# EAGLE design esp32-gps-eth-mod-gps-lora (EAGLE 7.3.0)
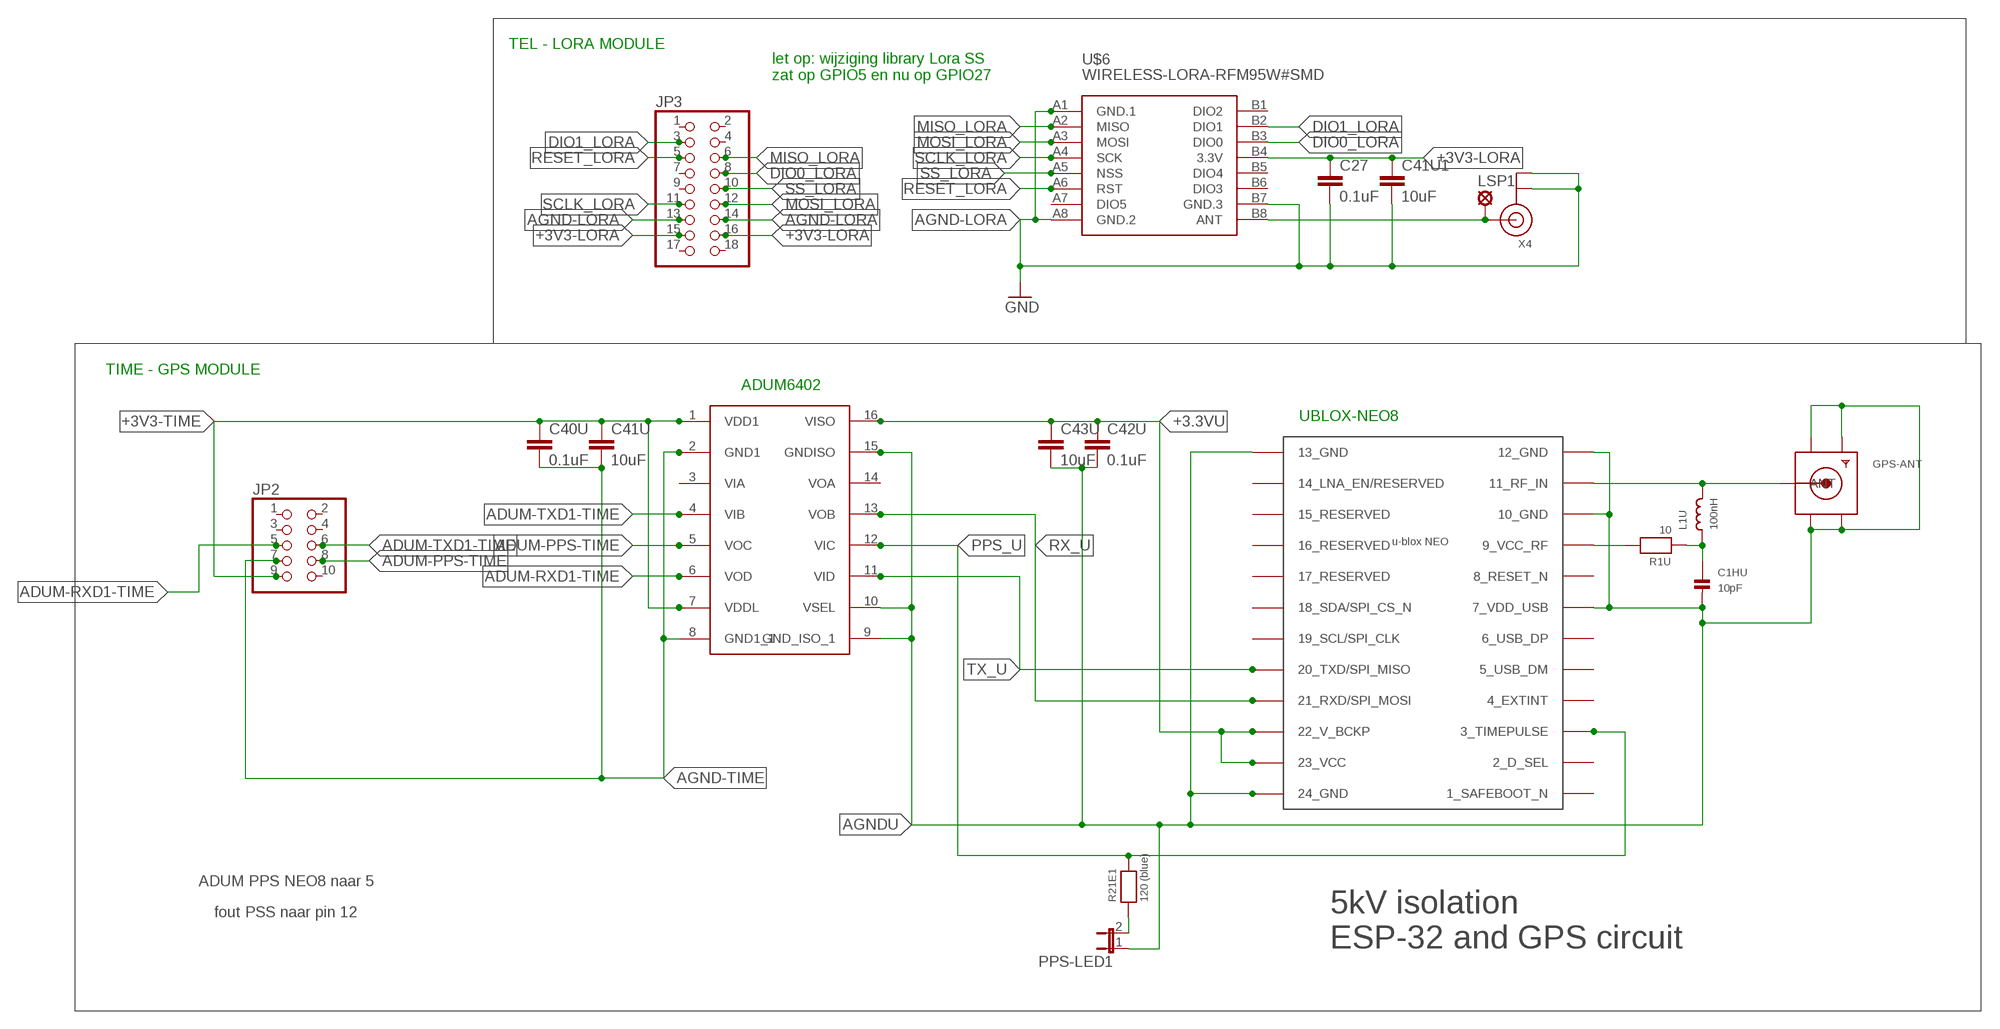
[diagram p0: schematic, sheet 1]

## Parts
C1HU  10pF  CAP_CERAMIC_0805  [_0805]
C27  0.1uF  C-EUC0805  [C0805]
C40U  0.1uF  C-EUC0805  [C0805]
C41U  10uF  C-EUC0805  [C0805]
C41U1  10uF  C-EUC0805  [C0805]
C42U  0.1uF  C-EUC0805  [C0805]
C43U  10uF  C-EUC0805  [C0805]
GPS-ANT  SMACONNECTOR  [SMA90_DIP]
JP2  PINHD-2X5/90  [2X05/90]
JP3  PINHD-2X9/90  [2X09/90]
L1U  100nH  INDUCTOR0805  [0805]
LSP1  LSP10  [LSP10]
PPS-LED1  JP1E  [JP1]
R1U  10  RESISTOR_0805  [_0805]
R21E1  120 (blue)  RESISTOR_0805  [_0805]
U$2  ADUM6402  [SOIC16R]
U$6  WIRELESS-LORA-RFM95W#SMD  [WIRELESS-LORA-RFM95W#SMD]
UBLOX-NEO8  NEO-M8  [NEO-M8]
X4  ANTENNA_U.FL  [U.FL]

## Nets
+3.3VU: C42U.1 C43U.1 U$2.16(VISO) UBLOX-NEO8.22(22_V_BCKP) UBLOX-NEO8.23(23_VCC)
+3V3-LORA: C27.1 C41U1.1 JP3.15 JP3.16 U$6.B4(3.3V)
+3V3-TIME: C40U.1 C41U.1 JP2.9 U$2.1(VDD1) U$2.7(VDDL)
ADUM-PPS-TIME: JP2.8 U$2.5(VOC)
ADUM-RXD1-TIME: JP2.5 U$2.6(VOD)
ADUM-TXD1-TIME: JP2.6 U$2.4(VIB)
AGND-LORA: C27.2 C41U1.2 JP3.13 JP3.14 U$6.A1(GND.1) U$6.A8(GND.2) U$6.B7(GND.3) X4.1(GND) X4.2(GND) ; supply symbol labelled GND
AGND-TIME: C40U.2 C41U.2 JP2.7 U$2.2(GND1) U$2.8(GND1_1)
AGNDU: C1HU.2 C42U.2 C43U.2 GPS-ANT.GND1 GPS-ANT.GND2 GPS-ANT.GND3 GPS-ANT.GND4 PPS-LED1.1 U$2.9(GND_ISO_1) U$2.10(VSEL) U$2.15(GNDISO) UBLOX-NEO8.7(7_VDD_USB) UBLOX-NEO8.10(10_GND) UBLOX-NEO8.12(12_GND) UBLOX-NEO8.13(13_GND) UBLOX-NEO8.24(24_GND)
DIO0_LORA: JP3.8 U$6.B3(DIO0)
DIO1_LORA: JP3.3 U$6.B2(DIO1)
MISO_LORA: JP3.6 U$6.A2(MISO)
MOSI_LORA: JP3.12 U$6.A3(MOSI)
N$7: PPS-LED1.2 R21E1.1
N$19: R1U.2 UBLOX-NEO8.9(9_VCC_RF)
N$27: LSP1.MP U$6.B8(ANT) X4.3(SIGNAL)
N$30: C1HU.1 L1U.1 R1U.1
N$31: GPS-ANT.ANTENNA(ANT) L1U.2 UBLOX-NEO8.11(11_RF_IN)
PPS_U: R21E1.2 U$2.12(VIC) UBLOX-NEO8.3(3_TIMEPULSE)
RESET_LORA: JP3.5 U$6.A6(RST)
RX_U: U$2.13(VOB) UBLOX-NEO8.21(21_RXD/SPI_MOSI)
SCLK_LORA: JP3.11 U$6.A4(SCK)
SS_LORA: JP3.10 U$6.A5(NSS)
TX_U: U$2.11(VID) UBLOX-NEO8.20(20_TXD/SPI_MISO)
Unconnected: JP2.1 JP2.2 JP2.3 JP2.4 JP2.10 JP3.1 JP3.2 JP3.4 JP3.7 JP3.9 JP3.17 JP3.18 U$2.3(VIA) U$2.14(VOA) U$6.A7(DIO5) U$6.B1(DIO2) U$6.B5(DIO4) U$6.B6(DIO3) UBLOX-NEO8.1(1_SAFEBOOT_N) UBLOX-NEO8.2(2_D_SEL) UBLOX-NEO8.4(4_EXTINT) UBLOX-NEO8.5(5_USB_DM) UBLOX-NEO8.6(6_USB_DP) UBLOX-NEO8.8(8_RESET_N) UBLOX-NEO8.14(14_LNA_EN/RESERVED) UBLOX-NEO8.15(15_RESERVED) UBLOX-NEO8.16(16_RESERVED) UBLOX-NEO8.17(17_RESERVED) UBLOX-NEO8.18(18_SDA/SPI_CS_N) UBLOX-NEO8.19(19_SCL/SPI_CLK)

## Notes on the sheet
- TEL - LORA MODULE
- let op: wijziging library Lora SS 
  zat op GPIO5 en nu op GPIO27
- TIME - GPS MODULE
- ADUM6402
- UBLOX-NEO8
- ADUM PPS NEO8 naar 5
- fout PSS naar pin 12
- 5kV isolation
  ESP-32 and GPS circuit

## Library data of the parts
C1HU = microbuilder:CAP_CERAMIC: Ceramic Capacitors 0402 - 0402 Surface Mount Capacitors 16pF 50V 5% [Digikey: 445-4899-2-ND] 18pF 50V 5% [Digikey: 490-1281-2-ND] 22pF 50V 5% [Digikey: 490-1283-2-ND] 68pF 50V 5% [Digikey: 490-1289-2-ND] 0.1uF 10V 10% [Digikey: 490-1318-2-ND] 1.0uF 6.3V 10% [Digikey: 490-1320-2-ND] 0603 - 0603 Surface Mount Capacitors 16 pF 50V 5% [Digikey: 445-5051-2-ND] 22 pF 50V [Digikey: PCC220ACVTR-ND] 33 pF 50V 5% [Digikey: 490-1415-1-ND] 56pF 50V 5% [Digikey: 490-1421-1-ND] 220pF 50V 5% [Digikey: 445-1285-1-ND] 680 pF 50V 2200 pF 50V 5% C0G [Digikey: 445-1297-1-ND] 5600 pF 100V 5% X7R [Digikey: 478-3711-1-ND] 0.1 µF 25V 10% [Digikey: PCC2277TR-ND] 0.22 µF 16V 10% X7R [Digikey: 445-1318-1-ND] 1.0 µF 25V 10% [Digikey: 445-5146-2-ND] 0603 - RF Specific 3pF 250V +/-0.1pF RF [Digikey: 712-1347-1-ND] 18 pF 250V 5% [Digikey: 478-3505-1-ND or 712-1322-1-ND] 56 pF 250V 5% C0G RF [Digikey: 490-4867-1-ND] 68 pF 250V RF [Digikey: 490-4868-1-ND] 0805 - 0805 Surface Mount Capacitors 220 pF 250V 2% RF Ceramic Capacitor [Digikey: 712-1398-1-ND] 1000 pF 50V 2% NP0 Ceramic Capacitor [Digikey: 478-3760-1-ND] 0.1 µF 25V 10% Ceramic Capacitor [Digikey: PCC1828TR-ND] 1.0 µF 16V 10% Ceramic Capacitor[Digikey: 490-1691-2-ND] 10.0 µF 10V 10% Ceramic Capacitor[Digikey: 709-1228-1-ND] 10.0 uF 16V 10% Ceramic Capacitor [Digikey: 478-5165-2-ND] 47 uF 6.3V 20% Ceramic Capacitor [Digikey: 587-1779-1-ND or 399-5506-1-ND] 1206 - 1206 Surface Mount Capacitors 47uF 10V 20% Ceramic Capacitor [Digikey: 490-5528-1-ND or 399-5508-1-ND or 445-6010-1-ND] 100uF 6.3V -20%, +80% Y5V Ceramic Capacitor (Digikey: 490-4512-1-ND, Mouser: 81-GRM31CF50J107ZE1L)
C27 C40U C41U C41U1 C42U C43U = Schematics:C-EU: CAPACITOR, European symbol
GPS-ANT = adafruit:SMACONNECTOR: SMA Connector 90° DIP SMA Connector, 50 Ohm (4UConnector: 07259)
JP2 = pinhead:PINHD-2X5: PIN HEADER
JP3 = pinhead:PINHD-2X9: PIN HEADER
L1U = microbuilder:INDUCTOR: Inductors 0603: 10nH Ceramic Inductor - microwire antenna/RF (Digikey: 712-1434-2-ND) 0805: 560nH Ceramic Inductor - RF (Digikey: 553-1047-1-ND) 270nH Ceramic Inductor - Q = 40@250MHz, +-5%, 1 Ohm DC Resistance (Digikey: 535-10506-2-ND) 1007 (2518 Metric) SMT: 10µH 10% 250mOhm 820mA 1007 Inductor (Digikey: 587-2189-1-ND) 22µH 10% 500mOhm 580mA 1007 Inductor (Digikey: 587-2190-1-ND) 47µH 10% 950mOhm 420mA 1007 Inductor (Digikey: 587-2191-1-ND) 47µH 5% 100mOhm 1A 1008 Inductor (Digikey: 732-1816-1-ND) 5.0x5.0mm (Taiyo Yuden NR5040 Series) 6.8µH 20% 2.3A 64mOhm Inductor (Digikey: 587-2374-2-ND) 5.0x5.0mm (TDK VLC5045 Series) 4.7µH 20% 3.3A 34mOhm Inductor (Digikey: 445-6526-1-ND) 6.8µH 20% 2.7A 46mOhm Inductor (Digikey: 445-6527-1-ND) 6.0x6.0mm (TDK VLC6045 Series) 4.7µH 20% 3.8A 27mOhm Inductor (Digikey: 445-6538-2-ND) 6.8µH 20% 3A 41mOhm Inductor (Digikey: 445-6540-1-ND) 6.2µH 30% 2.2A 45mOhm Inductor (Digikey: SRR5028-6R2YCT-ND) - Not TDK VLC6045 but footprint should match 6.0x6.0mm (TDK SLF6045 Series) 6.8uH 30% 2A 33mOhm Inductor (Digikey: 445-4572-1-ND, Mouser: 810-SLF645T6R8N2R0PF)
LSP1 = solpad:LSP10: SOLDER PAD drill 1.0 mm, distributor Buerklin, 12H555
PPS-LED1 = jumper:JP1E: JUMPER
R1U R21E1 = microbuilder:RESISTOR: Resistors 0402 - 0402 Surface Mount Package 22 Ohm 1% 1/16W [Digikey: 311-22.0LRTR-ND] 33 Ohm 5% 1/16W 1.0K 5% 1/16W 1.5K 5% 1/16W 2.0K 1% 1/16W 10.0K 1% 1/16W [Digikey: 311-10.0KLRTR-ND] 10.0K 5% 1/16W [Digikey: RMCF0402JT10K0TR-ND] 12.1K 1% 1/16W [Digikey: 311-22.0LRTR-ND] 100.0K 5% 1/16W 0603 - 0603 Surface Mount Package 0 Ohm 1/10 Watt 1% Resistor 15 Ohm 1/10 Watt 1% Resistor 33 Ohm 1/10 Watt 1% Resistor 49.9 Ohm 1/10 Watt 1% Resistor 100 Ohm 1/10 Watt 1% Resistor 150 Ohm 1/10 Watt 1% Resistor 240 Ohm 1/10 Watt 1% Resistor 390 Ohm 1/10 Watt 1% Resistor 560 Ohm 1/10 Watt 1% Resistor 680 Ohm 1/10 Watt 1% Resistor 750 Ohm 1/10 Watt 1% Resistor 1.0K Ohm 1/10 Watt 1% Resistor 1.5K Ohm 1/10 Watt 1% Resistor 2.0K Ohm 1/10 Watt 1% Resistor 2.2K Ohm 1/10 Watt 1% Resistor 3.3K Ohm 1/10 Watt 1% Resistor 4.7K Ohm 1/10 Watt 1% Resistor 10.0K Ohm 1/10 Watt 1% Resistor 12.0K Ohm 1/10 Watt 1% Resistor 12.1K Ohm 1/10 Watt 1% Resistor 20.0K Ohm 1/10 Watt 1% Resistor 33.0K Ohm 1/10 Watt 1% Resistor 100.0K Ohm 1/10 Watt 1% Resistor 0805 - 0805 Surface Mount Package 0 Ohm 1/8 Watt 1% Resistor 33 Ohm 1/8 Watt 1% Resistor 100 Ohm 1/8 Watt 1% Resistor 150 Ohm 1/8 Watt 1% Resistor 200 Ohm 1/8 Watt 1% Resistor 240 Ohm 1/8 Watt 1% Resistor 330 Ohm 1/8 Watt 1% Resistor 390 Ohm 1/8 Watt 1% Resistor 470 Ohm 1/8 Watt 1% Resistor 1.0K Ohm 1/8 Watt 1% Resistor 1.5K Ohm 1/8 Watt 1% Resistor 2.0K Ohm 1/8 Watt 1% Resistor 4.7K Ohm 1/8 Watt 1% Resistor 5.1K Ohm 1/8 Watt 1% Resistor 5.6K Ohm 1/8 Watt 1% Resistor 10.0K Ohm 1/8 Watt 1% Resistor 22.0K Ohm 1/8 Watt 1% Resistor 33.0K Ohm 1/8 Watt 1% Resistor 100K Ohm 1/8 Watt 1% Resistor 1206 - 1206 Surface Mount Package 2012 - 2010 Surface Mount Package 0.11 Ohm 1/2 Watt 1% Resistor - Digikey: RHM.11UCT-ND
U$2 = ADUM6402:ADUM6402
U$6 = diy-modules:WIRELESS-LORA-RFM95W: 868/915 MHz LoRa Radio Transceiver Module based on SX1276 chip Click here to find device on ebay.com <http://www.ebay.com/sch/RFM95W+transceiver>
UBLOX-NEO8 = ubloxLib:NEO-M8: u-blox NEO GNSS module
X4 = adafruit:ANTENNA_U.FL: U.FL Antenna Connector

## Board
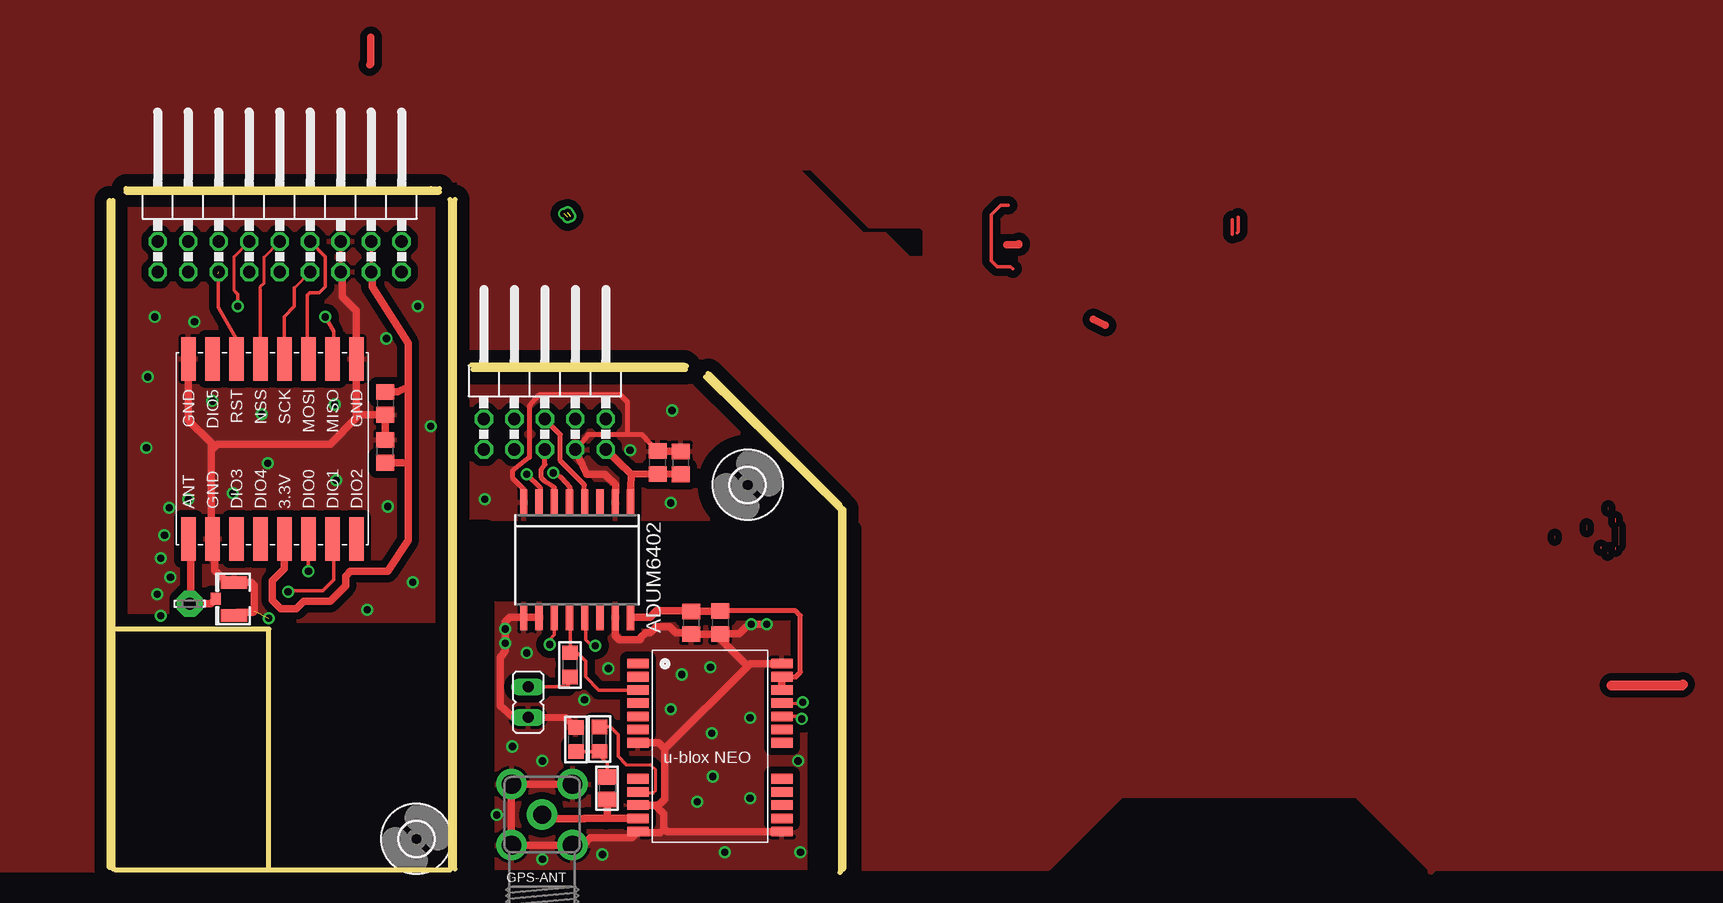
[diagram p1: board, top side]
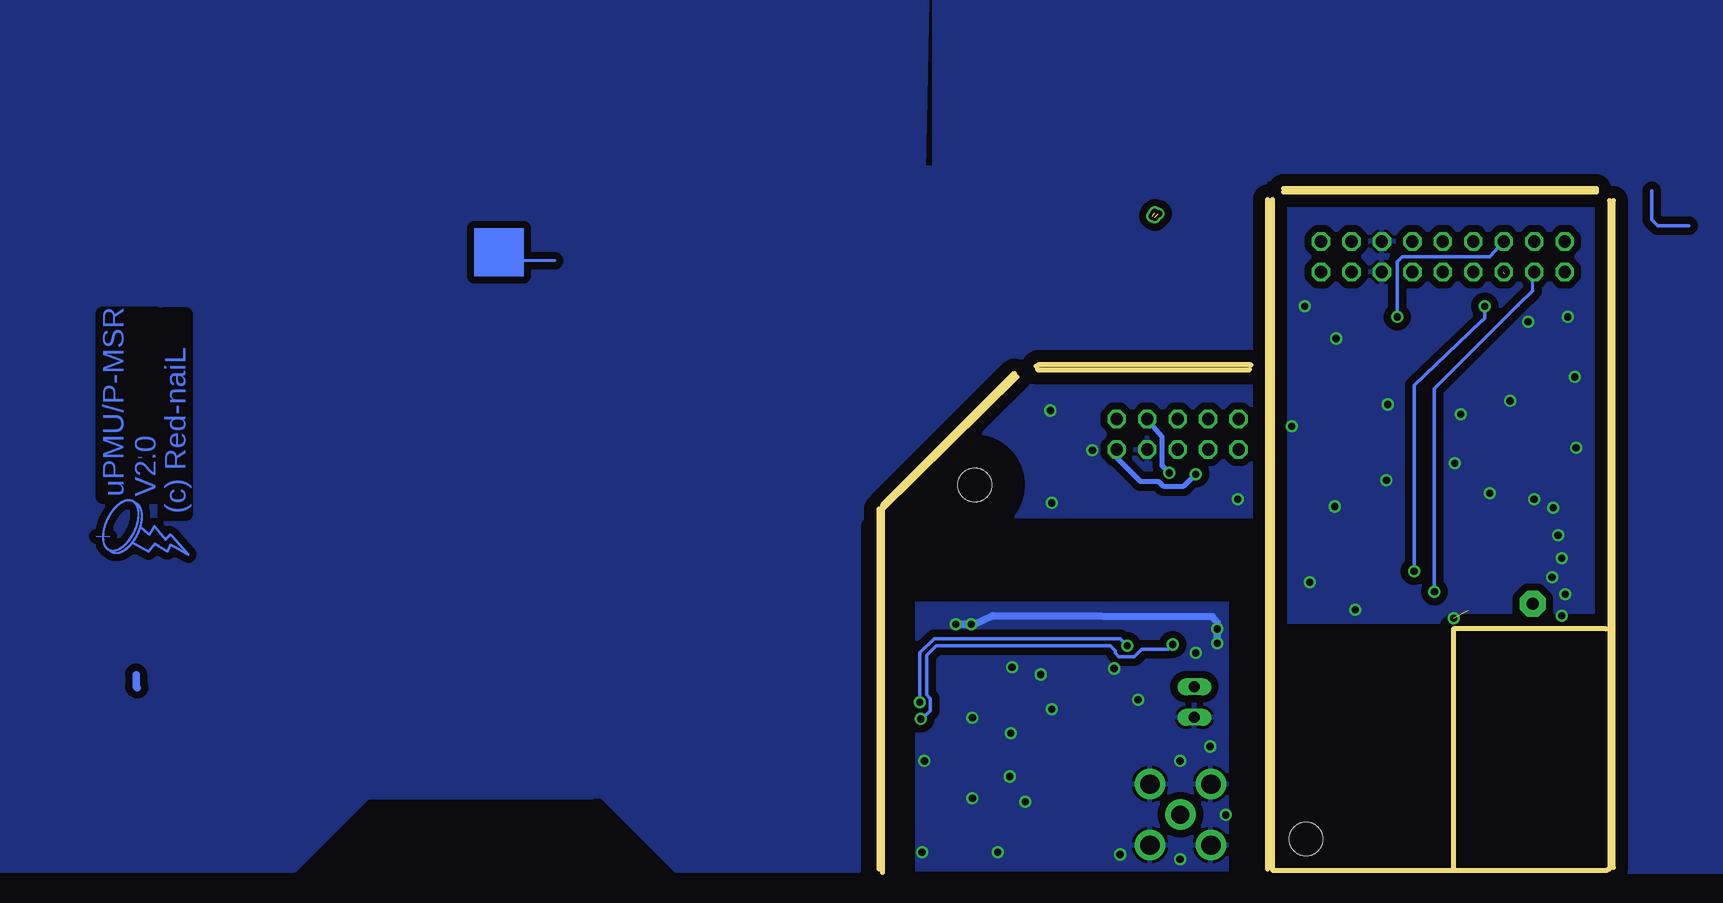
[diagram p2: board, bottom side, seen from below]

Size 61.2 x 57 mm. Coordinates in mm from the lower left corner, seen from the top.
Outline: 1.4,56.9 1.4,56.7
Outline: 1.4,56.7 27.5,56.7
Outline: 28.4,56.1 28.4,0.2 0.5,0.2 0.4,0.3
Outline: 13.3,0.3 13.3,20.3 0.6,20.3
Outline: 60.9,0 60.9,30.6 49.9,41.6
Outline: 28.8,0.3 28.8,56.1
Outline: 0,0.4 0,56
Outline: 1.4,57 26.8,57
Outline: 26.8,57 27.5,57
Outline: 1.4,56.7 26.8,57
Outline: 49.7,41.3 61,30.2
Outline: 61.2,30.3 61.2,0.3
Outline: 0.3,56 0.3,0.3
Outline: 48,41.9 30.3,41.9
Outline: 30.2,42.3 47.9,42.3 48.1,42.2
Copper layers (1*16): Top 0.035mm / dielectric 1.5mm / Bottom 0.035mm
Design rules "default *": minimum track width 5mil, minimum drill 24mil, track to track 5mil, track to pad 8mil, pad to pad 8mil, via to via 8mil, smd to smd 8mil, copper to edge 40mil, drill to drill 8mil, minimum pad ring 10mil, minimum via ring 8mil, stop-mask expansion 4mil, vias tented up to drill 0mil, thermal gap 10mil
tKeepout: area 28.3,23.4 to 62.2,28.8; area 28.8,-0.1 to 31.9,28.4; area 58.8,0.2 to 62.3,28.7
bKeepout: area 28.2,0.2 to 31.4,28.9; area 28.5,23.3 to 62.2,28.7; area 58.8,0.3 to 62.2,28.7
tRestrict: area 28.4,23.2 to 60.9,28.7; area 28.3,0.2 to 31.5,28.8; area 58.8,0.1 to 62.1,28.7; area 13.6,0.3 to 28.6,20.2
bRestrict: area 28.4,23.2 to 62.1,28.9; area 58.8,0.2 to 62.1,28.7; area 28.3,0.1 to 31.4,28.9; area 13.6,0.7 to 28.7,20.1

### Footprints (pad centres in the part's own frame; a part is rotated, then mirrored left to right if it is on the bottom)
_0805 = smd 1.2 x 1.3: 1 -1.016,0; 2 1.016,0
C0805 = smd 1.3 x 1.5: 1 -0.95,0; 2 0.95,0
SMA90_DIP = drill 1.5 pad 2.54: ANTENNA 0,0 | drill 1.6 pad 2.54: GND1 -2.54,2.54; GND2 2.54,2.54; GND3 -2.54,-2.54; GND4 2.54,-2.54
2X05/90 = drill 1.016 octagon: 1 -5.08,-6.35; 2 -5.08,-3.81; 3 -2.54,-6.35; 4 -2.54,-3.81; 5 0,-6.35; 6 0,-3.81; 7 2.54,-6.35; 8 2.54,-3.81; 9 5.08,-6.35; 10 5.08,-3.81
2X09/90 = drill 1.016 octagon: 1 -10.16,-6.35; 2 -10.16,-3.81; 3 -7.62,-6.35; 4 -7.62,-3.81; 5 -5.08,-6.35; 6 -5.08,-3.81; 7 -2.54,-6.35; 8 -2.54,-3.81; 9 0,-6.35; 10 0,-3.81; 11 2.54,-6.35; 12 2.54,-3.81; 13 5.08,-6.35; 14 5.08,-3.81; 15 7.62,-6.35; 16 7.62,-3.81; 17 10.16,-6.35; 18 10.16,-3.81
0805 = smd 1.3 x 1.5: 1 -0.95,0; 2 0.95,0
LSP10 = drill 1.016 pad 2.159 octagon: MP 0,0
JP1 = drill 0.914 long: 1 0,-1.27; 2 0,1.27
SOIC16R = smd 0.6 x 2.2: 1 -4.445,-4.775; 2 -3.175,-4.775; 3 -1.905,-4.775; 4 -0.635,-4.775; 5 0.635,-4.775; 6 1.905,-4.775; 7 3.175,-4.775; 8 4.445,-4.775; 9 4.445,4.8; 10 3.175,4.8; 11 1.905,4.8; 12 0.635,4.8; 13 -0.635,4.8; 14 -1.905,4.8; 15 -3.175,4.8; 16 -4.445,4.8
WIRELESS-LORA-RFM95W#SMD = smd 3.6 x 1.2: A1 -7.5,7; A2 -7.5,5; A3 -7.5,3; A4 -7.5,1; A5 -7.5,-1; A6 -7.5,-3; A7 -7.5,-5; A8 -7.5,-7; B1 7.5,7; B2 7.5,5; B3 7.5,3; B4 7.5,1; B5 7.5,-1; B6 7.5,-3; B7 7.5,-5; B8 7.5,-7
2,8 = hole 2.8: 0,0
NEO-M8 = smd 1.8 x 0.8: 1 6.4,-7.4; 2 6.4,-6.3; 3 6.4,-5.2; 4 6.4,-4.1; 5 6.4,-3; 6 6.4,-1.9; 7 6.4,-0.8; 8 6.4,2.2; 9 6.4,3.3; 10 6.4,4.4; 11 6.4,5.5; 12 6.4,6.6; 13 -5.6,6.6; 14 -5.6,5.5; 15 -5.6,4.4; 16 -5.6,3.3; 17 -5.6,2.2; 18 -5.6,-0.8; 19 -5.6,-1.9; 20 -5.6,-3; 21 -5.6,-4.1; 22 -5.6,-5.2; 23 -5.6,-6.3; 24 -5.6,-7.4
U.FL = smd 2.2 x 1.05: 1 0,1.375; 2 0,-1.375 | smd 0.8 x 1: 3 1.525,0

### Placement (x,y rotation side)
C1HU  38.89,11.09 90 top
C27  23,39.1 270 top
C40U  47.64,34.14 90 top
C41U  45.7,34.16 90 top
C41U1  23,35.1 90 top
C42U  48.48,20.81 270 top
C43U  50.91,20.84 270 top
GPS-ANT  36.06,4.82 180 top
JP2  36.3,41.6 0 top
JP3  14.2,56.4 0 top
L1U  41.5,7.02 270 top
LSP1  6.7,22.4 0 top
PPS-LED1  34.9,14.2 0 top
R1U  40.84,11.12 90 top
R21E1  38.4,17.3 90 top
U$2  38.99,26.07 180 top
U$6  13.6,35.3 270 top
U$7  [2,8]  25.6,2.8 0 top
U$8  [2,8]  53.2,32.3 0 top
UBLOX-NEO8  50.46,10.01 180 top
X4  10.4,22.8 180 top

### Tracks (layer width: path | path; a pad name or v marks a point on that pad's centre or on a via)
+3.3VU
  Top 0.406: UBLOX-NEO8.23 57.21,16.31 57.6,16.7 57.6,21.4 57.2,21.8 50.92,21.8 C43U.1
  Top 0.61: UBLOX-NEO8.22 UBLOX-NEO8.23 | U$2.16 45.07,21.27 45.6,21.8 48.44,21.8 C42U.1 50.88,21.76 C43U.1
+3V3-LORA
  Top 0.305: JP3.15 JP3.16
  Top 0.61: U$6.B4 14.6,25.3 13.6,24.3 13.6,22.7 14.3,22 15.6,22 16.2,22.6 18.4,22.6 19.7,23.9 19.7,24.7 20.1,25.1 23.2,25.1 24.9,27.7 24.9,34.1 | 24.9,34.1 24.9,40.5 | 24.9,40.5 24.9,44.1 21.9,48.8 21.9,49.97 JP3.15 | C27.1 24.05,40.05 24.9,40.5 | C41U1.1 24.45,34.15 24.9,34.1
+3V3-TIME  (via drill 0.6)
  Top 0.406: v34.8,33.2 35.9,32.1 35.9,30.93 U$2.7
  Top 0.61: U$2.1 43.5,33.2 | 43.5,33.2 JP2.9 | 43.5,33.2 C41U.1 C40U.1
  Bottom 0.406: JP2.9 41.38,34.58 39.4,32.6 37.9,32.6 37.5,32.2 35.8,32.2 v34.8,33.2
ADUM-PPS-TIME  (via drill 0.6)
  Top 0.406: U$2.5 38.4,32.1 37.7,32.9 v37,33.3
  Bottom 0.406: v37,33.3 37.6,33.9 37.6,36.3 JP2.8
ADUM-RXD1-TIME
  Top 0.406: U$2.6 37.1,32.1 36.3,32.6 36,32.9 36,33.6 36.3,34 JP2.5
ADUM-TXD1-TIME
  Top 0.406: U$2.4 39.6,32.3 37.6,34.3 37.6,36.5 JP2.6
AGND
  pour Top (isolate 0.61): -10.6,87.2 56.5,87.2 56.7,87 56.7,59.7 57.1,59.3 57.1,58.8 62.7,53.2 64.6,53.2 66.6,51.2 67.7,51.2 67.9,51 67.9,48.1 67.4,47.6 67.9,47.6 77.9,37.6 135.7,37.6 136,37.9 136,0.4 136.1,0.3 110.4,0.3 110.1,0 110.1,0.3 104,6.4 84.3,6.4 84.2,6.3 78.2,0.3 62.7,0.3 62.3,0.3 62.2,0.4 62.2,28.6 62,28.8 62,29.5 48.8,42.7 29.3,42.7 29.2,42.6 29.2,57.7 0.6,57.7 0.4,57.9 0.4,57.7 -0.7,56.6 -0.7,0.4 -0.5,0.2 -10.5,0.2 -10.5,87.1
  pour Bottom (isolate 0.61): -10.6,87.2 56.5,87.2 56.6,87.1 56.6,58.7 57.2,58.7 62.5,53.4 67.2,53.4 67.5,53.7 67.5,47.7 67.6,47.6 67.8,47.6 77.5,37.9 135.8,37.9 136.2,37.5 136.2,0.3 136.3,0.2 109.9,0.2 103.8,6.3 85.1,6.3 85,6.4 84.3,6.4 78.1,0.2 62.8,0.2 62.5,0.5 62.1,0.5 62,0.4 62,29.6 61.8,29.8 61.6,29.8 49.1,42.3 29.4,42.3 29.1,42.6 29.1,57.5 28.8,57.8 0.6,57.8 -0.5,56.7 -0.5,0.2 -0.6,0.1 -10.5,0.1 -10.6,0.2 -10.6,87.1 -10.8,87.3
AGND-LORA  (via drill 0.6)  (1 unrouted)
  Top 0.305: JP3.13 JP3.14
  Top 0.61: U$6.A8 6.6,37.7 8.5,35.8 8.5,35.2 | 8.5,35.2 8.5,27.9 U$6.B7 8.8,27.6 8.8,25.2 9.82,24.18 X4.2 11.82,24.18 12.1,23.9 12.1,21.8 12,21.7 10.68,21.7 X4.1 | 20.6,38.3 U$6.A1 20.6,46.8 19.4,48 19.4,49.93 JP3.13 | 20.6,38.3 20.6,37.9 18.4,35.7 9,35.7 8.5,35.2 | C41U1.2 C27.2 20.75,38.15 20.6,38.3
  other vias: 5.1,24.6 4,23.2 4.3,21.4 13.3,21.2 25.3,24.2 23.2,30.5 18.9,32.7 10.3,31.6 12.7,38.2 6.6,31.1 5,30.4 4.6,28.1 4.3,26.2 3.2,41.3 8.6,39.3 18.8,39 13.2,34.1 3.1,35.4 3.8,46.3 25.7,47.2 23.1,44.5 7.1,45.9 21.5,21.9 26.8,37.2
  pour Bottom (isolate 0.61): 1.5,56.5 27.9,56.5 27.8,0.7 13.8,0.7 14,20.3 13.6,20.5 0.9,20.5 0.9,56 0.8,56.3
  pour Top (isolate 0.61): 0.9,56.6 0.9,20.8 1,20.7 13.4,20.7 13.8,20.3 13.8,1 14.1,0.7 27.6,0.7 27.8,0.9 27.8,56.3 28,56.5 1,56.5
AGND-TIME  (via drill 0.6)
  Top 0.254: 39.8,33.2 39.8,33.4 39.4,33.8 39.4,34.3 39.3,34.4 39.3,34.8 38.8,35.3 38.8,35.4 39.9,36.5
  Top 0.406: C41U.2 44.4,36.5 43.2,36.5 | 43.2,36.5 39.9,36.5 JP2.7 | 43.2,36.5 43.2,39.2 42.6,39.8 35.8,39.8 35,38.9 35,34.6 33.6,33.5 33.6,32.9 34.5,32 34.5,30.89 U$2.8
  Top 0.61: C40U.2 C41U.2 | U$2.2 42.2,32.3 41.3,33.2 39.8,33.2 JP2.7
  other vias: 46.9,38.5 43.4,35.2 46.8,30.8 31.3,31.1
  pour Top (isolate 0.61): 29.4,40.6 29.4,28.5 29.6,28.2 60.2,28.2 60.2,29.7 48.7,41.1 29.3,41.3
  pour Bottom (isolate 0.61): 29.4,41.3 29.4,28.6 29.6,28.4 59.9,28.3 60.3,28.3 60.3,29.5 48.7,41.1 29.9,41.3
AGNDU  (via drill 0.6)
  Top 0.305: C1HU.2 38.1,12.8 34.6,12.9
  Top 0.61: UBLOX-NEO8.7 45.79,10.81 46.3,10.3 | 46.3,10.3 46.3,6.1 45.8,5.6 45.5,5.6 | UBLOX-NEO8.10 45.5,5.6 | 45.5,5.6 46.2,4.9 46.2,3.7 46.3,3.6 | 46.3,3.6 46.2,3.6 45.9,3.3 44.17,3.3 UBLOX-NEO8.12 43.55,2.9 40.1,2.9 39.48,2.28 GPS-ANT.GND1 GPS-ANT.GND2 33.5,2.3 33.5,7.3 33.56,7.36 GPS-ANT.GND3 GPS-ANT.GND4 | UBLOX-NEO8.13 46.49,3.41 46.3,3.6 | UBLOX-NEO8.24 53.41,17.41 53.2,17.2 | 53.2,17.2 46.3,10.3 | U$2.15 42.17,19.73 42.5,19.4 44.2,19.4 44.3,19.5 44.3,19.6 44.7,20 45.1,20 45.6,20.5 46.7,20.5 47.2,20 48.34,20 C42U.2 50.88,19.86 C43U.2 | C43U.2 50.91,19.5 53.2,17.2 | U$2.9 U$2.10 33.37,21.27 33,20.9 v33,20.3 v33,19.1 33,18.5 32.6,17.9 32.6,13.9 33.7,12.9 34.6,12.9 | v54.8,20.7 v53.5,20.7 53.3,20.7 52.5,19.9 C43U.2 | C1HU.2 38,12.9 PPS-LED1.1
  Bottom 0.61: v33,19.1 v33,20.3 33,20.8 33.4,21.3 51.7,21.4 53.2,20.7 v53.5,20.7 v54.8,20.7
  other vias: 34.8,18.3 39.6,14.4 41.6,17 47.7,16.5 53.4,12.9 53.4,6.2 49,5.9 57.6,1.7 51.3,1.7 57.4,9.3 50.2,11.6 46.8,13.6 50.1,17.1 36.1,9.3 33.6,10.5 32.3,4.8 36.1,1.1 41.1,1.5 50.3,8
  pour Top (isolate 0.61): 31.6,23.2 58.6,23.2 58.7,23.1 58.7,0.6 58.9,0.4 31.5,0.4 31.6,22.3
  pour Bottom (isolate 0.61): 32.1,23.2 58.7,23.1 58.8,23 58.8,0.4 58.9,0.3 31.5,0.3 31.6,22.5 31.6,23.2
DIO0_LORA  (via drill 0.6)
  Top 0.254: 10.5,48.4 10.4,48.5 10.4,51.33 JP3.8
  Top 0.305: U$6.B3 v16.6,25.1 | v10.7,47.2 10.7,48.2 10.5,48.4
  Bottom 0.305: v16.6,25.1 16.6,40.6 12,45 10.9,46.01 10.89,46.01 10.7,46.2 v10.7,47.2
DIO1_LORA  (via drill 0.6)
  Top 0.305: U$6.B2 18.6,27.6 18.7,27.5 18.7,24.4 17.8,23.5 15,23.5 v14.9,23.4
  Bottom 0.254: 6.7,48.5 6.7,49.93 JP3.3
  Bottom 0.305: v14.9,23.4 14.9,40.3 7.9,47.3 | 7.9,47.3 7.9,47.27 | 7.9,47.3 6.7,48.5
GND-ADE900
  pour Top (isolate 0.61): 57,87.2 57,59 57.2,58.8 58.6,58.8 63.4,54 67.7,54 68.1,53.6 68.1,47.5 69.6,46 69.9,46 78.1,37.8 135.1,37.8 135.4,38.1 135.4,87.1 135.3,87.2
  pour Bottom (isolate 0.61): 56.9,87 57.5,58.5 62.4,53.6 67.4,53.6 67.5,53.5 67.5,47.5 69,46 69.3,46 77.2,38.1 135.9,38.1 136.4,38.6 136.4,87.3 136.3,87.4 57.7,87.3 57.3,87.2
MISO_LORA  (via drill 0.6)  (1 unrouted)
  Top 0.305: v18,46.3 18.7,45.1 18.7,42.9 U$6.A2
  Bottom 0.305: 9.12,52.62 10.3,51.3 17.6,51.3 18,50.9 v18,46.3
MOSI_LORA
  Top 0.305: U$6.A3 16.5,42.9 16.5,48.1 16.54,48.16 16.56,48.16 16.7,48.3 17.5,48.3 18,48.8 18,51.33 JP3.12
N$4  (via drill 0.6)  (3 unrouted)
  other vias: 38.2,55 38.4,54.7 38.3,54.9 37.9,54.9 38.2,54.6
N$7
  Top 0.305: PPS-LED1.2 36,15.5 38.2,15.5 R21E1.1
N$9
  Bottom 0.305: -6.3,53.9 -3.7,53.9 -3.2,54.4 -3.2,56.8
N$10
  Top 0.61: 21.8,69.6 21.8,67.4 21.7,67.3
N$19
  Top 0.254: 43.1,9 45.1,9 45.5,8.6 45.5,6.8 45.3,6.6 44.17,6.6 UBLOX-NEO8.9
  Top 0.305: R1U.2 41.76,12.14 42.4,11.5 42.4,9.7 43.1,9
N$27
  Top 0.305: U$6.B8 6.6,27.2 6.8,27
  Top 0.61: 6.8,27 6.8,22.5 LSP1.MP 8.48,22.4 X4.3
N$30
  Top 0.305: C1HU.1 40.81,10.07 R1U.1 40.84,9.76 41.5,9.1 L1U.1
N$31
  Top 0.61: UBLOX-NEO8.11 41.4,4.51 | 41.4,4.51 39.61,4.51 39.6,4.5 36.39,4.5 GPS-ANT.ANTENNA | L1U.2 41.5,4.61 41.4,4.51
N$36
  Top 0.305: 93.6,54.4 93.6,53.2
N$37
  Top 0.305: 94.1,54.6 94.1,53.4 94,53.3
N$49
  Bottom 0.254: 88.2,51 92.7,51
N$53
  Top 0.61: 74.8,52.3 75.8,52.3 75.8,52.4
N$79
  Top 0.61: 82,46.1 83,45.6
N$88
  Top 0.305: 74.9,55.6 74.3,55.6 73.5,54.8 73.5,51 74,50.5 75.1,50.5 75.3,50.3
N$116
  Top 0.813: 125.2,15.6 131.05,15.6 131.12,15.68
N$117
  Bottom 0.61: 123.1,16.5 123.1,15.5 123,15.4
PPS_U
  Top 0.305: U$2.12 38.4,21.22 R21E1.2 38.98,18.32 39.7,17.6 39.7,16.3 40.8,15.2 UBLOX-NEO8.3
RESET_LORA  (1 unrouted)
  Top 0.305: U$6.A6 10.6,44.5 9.1,47.1 9.1,49.91
RX_U  (via drill 0.6)
  Top 0.254: UBLOX-NEO8.21 57.71,14.11 v57.8,14.2
  Top 0.305: v40.5,18.9 40.2,18.9 39.7,19.4 39.7,21.19 U$2.13
  Bottom 0.305: v57.8,14.2 57.8,18.3 56.6,19.5 41.1,19.5 v40.5,18.9
SCLK_LORA
  Top 0.254: 15.4,48.75 15.44,48.75 JP3.11
  Top 0.305: 14.8,42.8 U$6.A4 14.6,46.3 15.4,47.2 15.4,48.75
SS_LORA
  Top 0.254: 12.6,48.55 12.6,48.8 12.9,49.1 12.9,51.29 JP3.10
  Top 0.305: U$6.A5 12.6,48.55
TX_U  (via drill 0.6)
  Top 0.305: UBLOX-NEO8.20 57.49,13.01 v57.7,12.8 | v36.7,19 36.7,19.4 37.1,19.8 37.1,21.25 U$2.11
  Bottom 0.305: v57.7,12.8 57.6,12.8 56.9,13.5 56.9,14.5 57.2,14.8 57.2,18.1 56.4,18.9 41.9,18.9 41.5,18.5 41.5,18.3 41.2,18 39.9,18 39.3,18.6 37.1,18.6 v36.7,19
(copper drawn outside any net)
  shapes: Bottom area x1354, Top area x11

### Text on the board
Bottom: uPMU/P-MSR / V2.0 | (c) Red-naiL